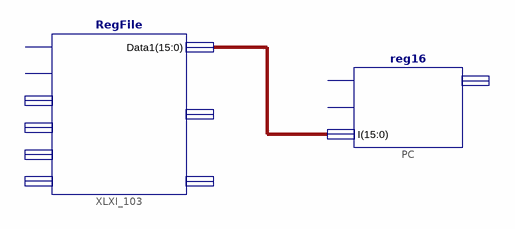
[diagram p0: schematic sheet 1]
// Xilinx ISE schematic jr.sch (spartan3adsp) as structural Verilog: 2 symbols, 0 ports
module jr (
);

  wire [15:0] XLXN_5;

  RegFile XLXI_103 (.Data1(XLXN_5));  // open: RegWrite, clock, Read1, Read2, WriteReg, WriteData, Data2, Data3
  reg16 PC (.I(XLXN_5));  // open: CLK, Write, O
endmodule
